# Altium schematic sheet Interface_Load_Switching.SchDoc
size B; SheetNumber: 14; SheetTotal: 16
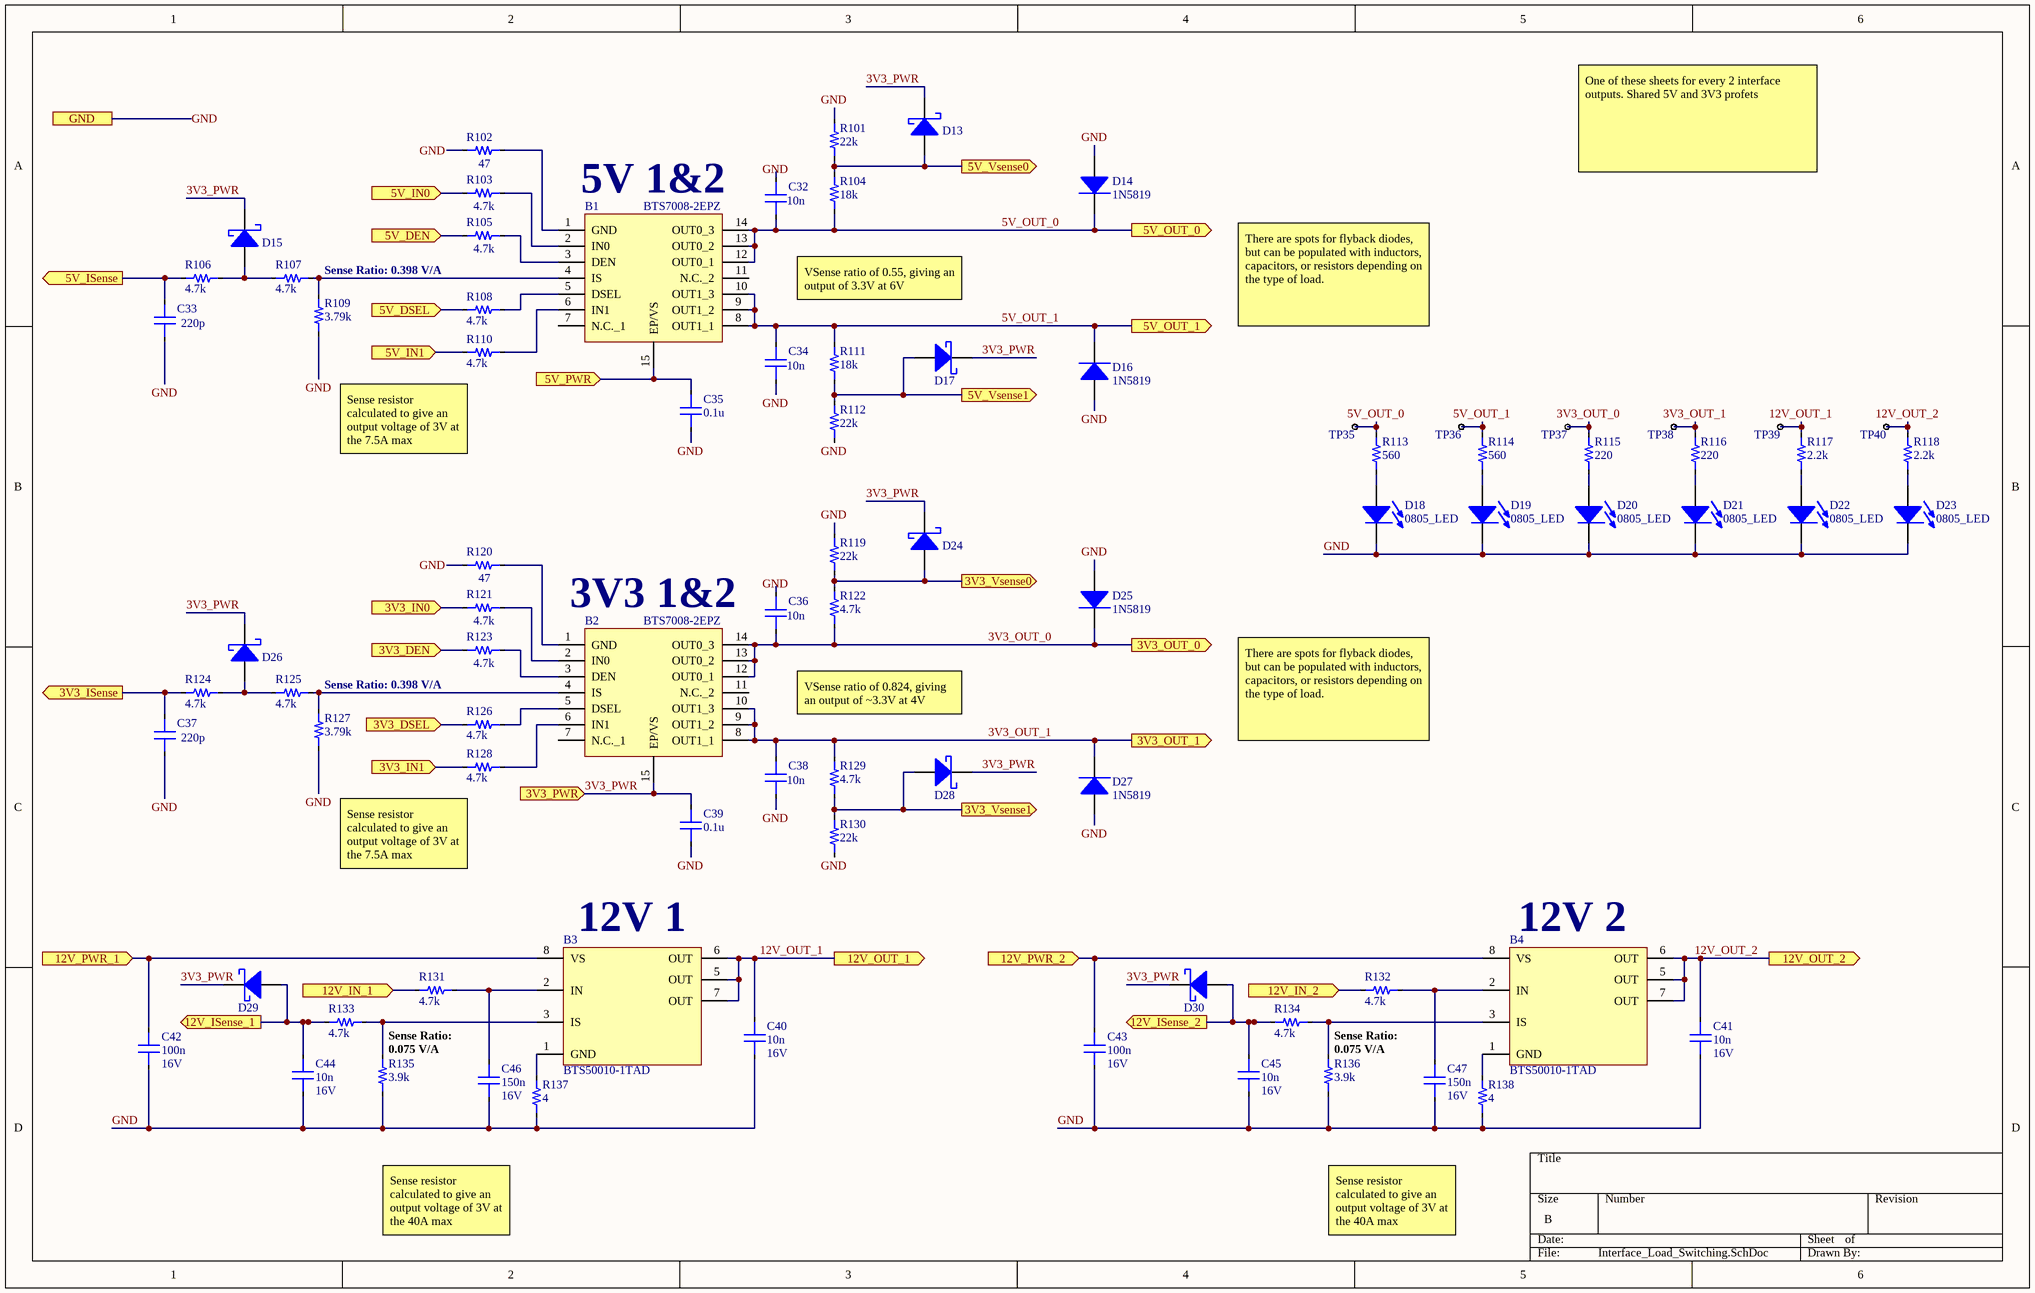
[diagram p0: Interface_Load_Switching.SchDoc]

## Parts
B1  BTS7008-2EPZ  [SOP65P600X115-15N]
B2  BTS7008-2EPZ  [SOP65P600X115-15N]
B3  BTS50010-1TAD  [TO-263-7]
B4  BTS50010-1TAD  [TO-263-7]
C32  value 10n  [0603_CAP]  (hidden comment: Capacitor)
C33  value 220p  [0603_CAP]  (hidden comment: Capacitor)
C34  value 10n  [0603_CAP]  (hidden comment: Capacitor)
C35  value 0.1u  [0603_CAP]  (hidden comment: Capacitor)
C36  value 10n  [0603_CAP]  (hidden comment: Capacitor)
C37  value 220p  [0603_CAP]  (hidden comment: Capacitor)
C38  value 10n  [0603_CAP]  (hidden comment: Capacitor)
C39  value 0.1u  [0603_CAP]  (hidden comment: Capacitor)
C40  value 10n  Voltage: 16V  [0603_CAP]  (hidden comment: Capacitor)
C41  value 10n  Voltage: 16V  [0603_CAP]  (hidden comment: Capacitor)
C42  value 100n  Voltage: 16V  [0603_CAP]  (hidden comment: Capacitor)
C43  value 100n  Voltage: 16V  [0603_CAP]  (hidden comment: Capacitor)
C44  value 10n  Voltage: 16V  [0603_CAP]  (hidden comment: Capacitor)
C45  value 10n  Voltage: 16V  [0603_CAP]  (hidden comment: Capacitor)
C46  value 150n  Voltage: 16V  [0603_CAP]  (hidden comment: Capacitor)
C47  value 150n  Voltage: 16V  [0603_CAP]  (hidden comment: Capacitor)
D13  RBR2MM30BTFTR  [SOD-123F]  (value not drawn)
D14  1N5819  [SOD-123F]
D15  RBR2MM30BTFTR  [SOD-123F]  (value not drawn)
D16  1N5819  [SOD-123F]
D17  RBR2MM30BTFTR  [SOD-123F]  (value not drawn)
D18  0805_LED  [0805_LED]
D19  0805_LED  [0805_LED]
D20  0805_LED  [0805_LED]
D21  0805_LED  [0805_LED]
D22  0805_LED  [0805_LED]
D23  0805_LED  [0805_LED]
D24  RBR2MM30BTFTR  [SOD-123F]  (value not drawn)
D25  1N5819  [SOD-123F]
D26  RBR2MM30BTFTR  [SOD-123F]  (value not drawn)
D27  1N5819  [SOD-123F]
D28  RBR2MM30BTFTR  [SOD-123F]  (value not drawn)
D29  RBR2MM30BTFTR  [SOD-123F]  (value not drawn)
D30  RBR2MM30BTFTR  [SOD-123F]  (value not drawn)
R101  value 22k  [0603_RES]  (hidden comment: Resistor)
R102  value 47  [0603_RES]  (hidden comment: Resistor)
R103  value 4.7k  [0603_RES]  (hidden comment: R(IN))
R104  value 18k  [0603_RES]  (hidden comment: Resistor)
R105  value 4.7k  [0603_RES]  (hidden comment: Resistor)
R106  value 4.7k  [0603_RES]  (hidden comment: Resistor)
R107  value 4.7k  [0603_RES]  (hidden comment: Resistor)
R108  value 4.7k  [0603_RES]  (hidden comment: Resistor)
R109  value 3.79k  [0603_RES]  (hidden comment: Resistor)
R110  value 4.7k  [0603_RES]  (hidden comment: Resistor)
R111  value 18k  [0603_RES]  (hidden comment: Resistor)
R112  value 22k  [0603_RES]  (hidden comment: Resistor)
R113  value 560  [0603_RES]  (hidden comment: Resistor)
R114  value 560  [0603_RES]  (hidden comment: Resistor)
R115  value 220  [0603_RES]  (hidden comment: Resistor)
R116  value 220  [0603_RES]  (hidden comment: Resistor)
R117  value 2.2k  [0603_RES]  (hidden comment: Resistor)
R118  value 2.2k  [0603_RES]  (hidden comment: Resistor)
R119  value 22k  [0603_RES]  (hidden comment: Resistor)
R120  value 47  [0603_RES]  (hidden comment: Resistor)
R121  value 4.7k  [0603_RES]  (hidden comment: R(IN))
R122  value 4.7k  [0603_RES]  (hidden comment: Resistor)
R123  value 4.7k  [0603_RES]  (hidden comment: Resistor)
R124  value 4.7k  [0603_RES]  (hidden comment: Resistor)
R125  value 4.7k  [0603_RES]  (hidden comment: Resistor)
R126  value 4.7k  [0603_RES]  (hidden comment: Resistor)
R127  value 3.79k  [0603_RES]  (hidden comment: Resistor)
R128  value 4.7k  [0603_RES]  (hidden comment: Resistor)
R129  value 4.7k  [0603_RES]  (hidden comment: Resistor)
R130  value 22k  [0603_RES]  (hidden comment: Resistor)
R131  value 4.7k  [0603_RES]  (hidden comment: Resistor)
R132  value 4.7k  [0603_RES]  (hidden comment: Resistor)
R133  value 4.7k  [0603_RES]  (hidden comment: Resistor)
R134  value 4.7k  [0603_RES]  (hidden comment: Resistor)
R135  value 3.9k  [0603_RES]  (hidden comment: Resistor)
R136  value 3.9k  [0603_RES]  (hidden comment: Resistor)
R137  value 4  [0805_RES]  (hidden comment: Resistor)
R138  value 4  [0805_RES]  (hidden comment: Resistor)
TP35  1mm Testpoint  [1mm_testpoint]  (value not drawn)
TP36  1mm Testpoint  [1mm_testpoint]  (value not drawn)
TP37  1mm Testpoint  [1mm_testpoint]  (value not drawn)
TP38  1mm Testpoint  [1mm_testpoint]  (value not drawn)
TP39  1mm Testpoint  [1mm_testpoint]  (value not drawn)
TP40  1mm Testpoint  [1mm_testpoint]  (value not drawn)

## Ports
3V3_DEN (in), 3V3_DSEL (in), 3V3_IN0 (in), 3V3_IN1 (in), 3V3_ISense (out), 3V3_OUT_0 (out), 3V3_OUT_1 (out), 3V3_PWR (in), 3V3_Vsense0 (out), 3V3_Vsense1 (out), 5V_DEN (in), 5V_DSEL (in), 5V_IN0 (in), 5V_IN1 (in), 5V_ISense (out), 5V_OUT_0 (out), 5V_OUT_1 (out), 5V_PWR (in), 5V_Vsense0 (out), 5V_Vsense1 (out), 12V_IN_1 (in), 12V_IN_2 (in), 12V_ISense_1 (out), 12V_ISense_2 (out), 12V_OUT_1 (out), 12V_OUT_2 (out), 12V_PWR_1 (in), 12V_PWR_2 (in), GND

## Nets
3V3_DEN: R123.2 ; port 3V3_DEN
3V3_DSEL: R126.1 ; port 3V3_DSEL
3V3_IN0: R121.2 ; port 3V3_IN0
3V3_IN1: R128.2 ; port 3V3_IN1
3V3_ISense: C37.2 R124.1 ; port 3V3_ISense
3V3_OUT_0: B2.12(OUT0_1) B2.13(OUT0_2) B2.14(OUT0_3) C36.1 D25.1 R115.2 R122.1 TP37.1 ; port 3V3_OUT_0
3V3_OUT_1: B2.8(OUT1_1) B2.9(OUT1_2) B2.10(OUT1_3) C38.2 D27.1 R116.2 R129.1 TP38.1 ; port 3V3_OUT_1
3V3_PWR: B2.15(EP/VS) C39.2 D13.1(K) D15.1(K) D17.1(K) D24.1(K) D26.1(K) D28.1(K) D29.1(K) D30.1(K) ; port 3V3_PWR
3V3_Vsense0: D24.2(A) R119.1 R122.2 ; port 3V3_Vsense0
3V3_Vsense1: D28.2(A) R129.2 R130.1 ; port 3V3_Vsense1
5V_DEN: R105.2 ; port 5V_DEN
5V_DSEL: R108.1 ; port 5V_DSEL
5V_IN0: R103.2 ; port 5V_IN0
5V_IN1: R110.2 ; port 5V_IN1
5V_ISense: C33.2 R106.1 ; port 5V_ISense
5V_OUT_0: B1.12(OUT0_1) B1.13(OUT0_2) B1.14(OUT0_3) C32.1 D14.1 R104.1 R113.2 TP35.1 ; port 5V_OUT_0
5V_OUT_1: B1.8(OUT1_1) B1.9(OUT1_2) B1.10(OUT1_3) C34.2 D16.1 R111.1 R114.2 TP36.1 ; port 5V_OUT_1
5V_PWR: B1.15(EP/VS) C35.2 ; port 5V_PWR
5V_Vsense0: D13.2(A) R101.1 R104.2 ; port 5V_Vsense0
5V_Vsense1: D17.2(A) R111.2 R112.1 ; port 5V_Vsense1
12V_IN_1: R131.1 ; port 12V_IN_1
12V_IN_2: R132.1 ; port 12V_IN_2
12V_ISense_1: C44.2 D29.2(A) R133.1 ; port 12V_ISense_1
12V_ISense_2: C45.2 D30.2(A) R134.1 ; port 12V_ISense_2
12V_OUT_1: B3.5(OUT) B3.6(OUT) B3.7(OUT) C40.2 R117.2 TP39.1 ; port 12V_OUT_1
12V_OUT_2: B4.5(OUT) B4.6(OUT) B4.7(OUT) C41.2 R118.2 TP40.1 ; port 12V_OUT_2
12V_PWR_1: B3.8(VS) C42.2 ; port 12V_PWR_1
12V_PWR_2: B4.8(VS) C43.2 ; port 12V_PWR_2
GND: C32.2 C33.1 C34.1 C35.1 C36.2 C37.1 C38.1 C39.1 C40.1 C41.1 C42.1 C43.1 C44.1 C45.1 C46.1 C47.1 D14.2 D16.2 D18.2(K) D19.2(K) D20.2(K) D21.2(K) D22.2(K) D23.2(K) D25.2 D27.2 R101.2 R102.2 R109.1 R112.2 R119.2 R120.2 R127.1 R130.2 R135.1 R136.1 R137.1 R138.1 ; port GND
NetB1_1: B1.1(GND) R102.1
NetB1_2: B1.2(IN0) R103.1
NetB1_3: B1.3(DEN) R105.1
NetB1_4: B1.4(IS) R107.2 R109.2
NetB1_5: B1.5(DSEL) R108.2
NetB1_6: B1.6(IN1) R110.1
NetB2_1: B2.1(GND) R120.1
NetB2_2: B2.2(IN0) R121.1
NetB2_3: B2.3(DEN) R123.1
NetB2_4: B2.4(IS) R125.2 R127.2
NetB2_5: B2.5(DSEL) R126.2
NetB2_6: B2.6(IN1) R128.1
NetB3_1: B3.1(GND) R137.2
NetB3_2: B3.2(IN) C46.2 R131.2
NetB3_3: B3.3(IS) R133.2 R135.2
NetB4_1: B4.1(GND) R138.2
NetB4_2: B4.2(IN) C47.2 R132.2
NetB4_3: B4.3(IS) R134.2 R136.2
NetD15_2: D15.2(A) R106.2 R107.1
NetD18_1: D18.1(A) R113.1
NetD19_1: D19.1(A) R114.1
NetD20_1: D20.1(A) R115.1
NetD21_1: D21.1(A) R116.1
NetD22_1: D22.1(A) R117.1
NetD23_1: D23.1(A) R118.1
NetD26_2: D26.2(A) R124.2 R125.1

Not connected (* = marked no-connect by the designer): B1 7(N.C._1) 11(N.C._2); B2 7(N.C._1) 11(N.C._2)

## Notes on the sheet
- One of these sheets for every 2 interface outputs. Shared 5V and 3V3 profets
- (near B1) 5V 1&2
- Sense Ratio: 0.398 V/A
- VSense ratio of 0.55, giving an output of 3.3V at 6V
- There are spots for flyback diodes, but can be populated with inductors, capacitors, or resistors depending on the type of load.
- (near R110) Sense resistor calculated to give an output voltage of 3V at the 7.5A max
- (near B2) 3V3 1&2
- VSense ratio of 0.824, giving an output of ~3.3V at 4V
- (near R128) Sense resistor calculated to give an output voltage of 3V at the 7.5A max
- (near B3) 12V 1
- (near B4) 12V 2
- (near R135) Sense Ratio:
  0.075 V/A
- (near R136) Sense Ratio:
  0.075 V/A
- Sense resistor calculated to give an output voltage of 3V at the 40A max

## Library data of the parts
B1 B2 = BTS7008-2EPZ: PROFET +2 12V Smart High-Side Power Switch; Manufacturer_Name: Infineon; Geometry.Height: 1.15mm; Manufacturer_Part_Number: BTS7008-2EPZ; Mouser Part Number: *; Mouser Price/Stock: *; Arrow Part Number: *; Arrow Price/Stock: *; Mouser Testing Part Number: *; Mouser Testing Price/Stock: *; Datasheet Link: https://4donline.ihs.com/images/VipMasterIC/IC/INFN/INFN-S-A0012431809/INFN-S-A0012432886-1.pdf?hkey=EF798316E3902B6ED9A73243A3159BB0; Supplier 1: Mouser; Supplier Part Number 1: 726-BTS70082EPZXUMA1
B3 B4 = BTS50010-1TAD: Power Switch/Driver 1:1 N-Channel 48A P/PG-TO-263-7-10; ComponentLink1Description: Digikey; ComponentLink1URL: https://www.digikey.com/en/products/detail/infineon-technologies/BTS500101TADATMA2/9693060; ComponentLink2Description: Datasheet; ComponentLink2URL: https://www.infineon.com/dgdl/Infineon-BTS50010-1TAD-DS-v01_01-EN.pdf?fileId=5546d462576f34750157c38810ca55cd
C32 C34 C36 C38 = Capacitor: Protection of BTS7008-2EPZ output during ESD events and BCI; Voltage: 16V; Dielectric: *; Percent Tolerance: *; ESR: *
C33 C37 = Capacitor: Sense signal filtering; Voltage: 16V; Dielectric: *; Percent Tolerance: *; ESR: *
D13 D15 D17 D24 D26 D28-D30 = RBR2MM30BTFTR: Diode Schottky 30 V 2A Surface Mount SOD-123F; Vr: 30; Num_Circuits: 1; Vf: 490 mV @ 2 A; Package: SOD-123F; ComponentLink1Description: Digikey; ComponentLink1URL: https://www.digikey.com/en/products/detail/rohm-semiconductor/RBR2MM30BTFTR/9748137
D14 D16 D25 D27 = 1N5819: Diode Super Barrier 40V 1A Surface Mount SOD-123F; Num_Circuits: 1; Vr: 40V; Package: SOD-123F; ComponentLink1Description: Digikey; ComponentLink1URL: https://www.digikey.com/product-detail/en/diodes-incorporated/1N5819HW1-7-F/1N5819HW1-7-FDITR-ND/5768523
D18-D23 = 0805_LED: Generic 0805 LED; Color: Green
R101 R104 R119 R122 R135 R136 = Resistor: Tolerance: 1%
R103 R105 R110 R121 R123 R128 = Resistor: Protection of the microcontroller during Overvoltage and Reverse Polarity / Necessary to switch OFF BTS7008-2EPZ output during Loss of Ground; Tolerance: *
R106 R124 = Resistor: Protection of microcontroller ADC input during Overvoltage, Reverse / Polarity, Loss of Ground / Value to be tuned according to microcontroller specifications; Tolerance: *
R109 R127 = Resistor: SENSE resistor; Tolerance: 1%
R111 R112 R129 R130 = Resistor: Protection of the microcontroller during Overvoltage and Reverse Polarity / Necessary to switch OFF BTS7008-2EPZ output during Loss of Ground; Tolerance: 1%
TP35-TP40 = 1mm Testpoint: 1mm test point; ComponentLink1Description: Digikey; ComponentLink1URL: https://www.digikey.com/product-detail/en/te-connectivity-amp-connectors/RCU-0C/A106145CT-ND/3477802
C35 C39-C47 = Capacitor: Dielectric: *; Percent Tolerance: *; ESR: *
R102 R107 R108 R113-R118 R120 R125 R126 R131-R134 R137 R138 = Resistor: Tolerance: *